# Altium schematic sheet K60P144.SchDoc
size A3
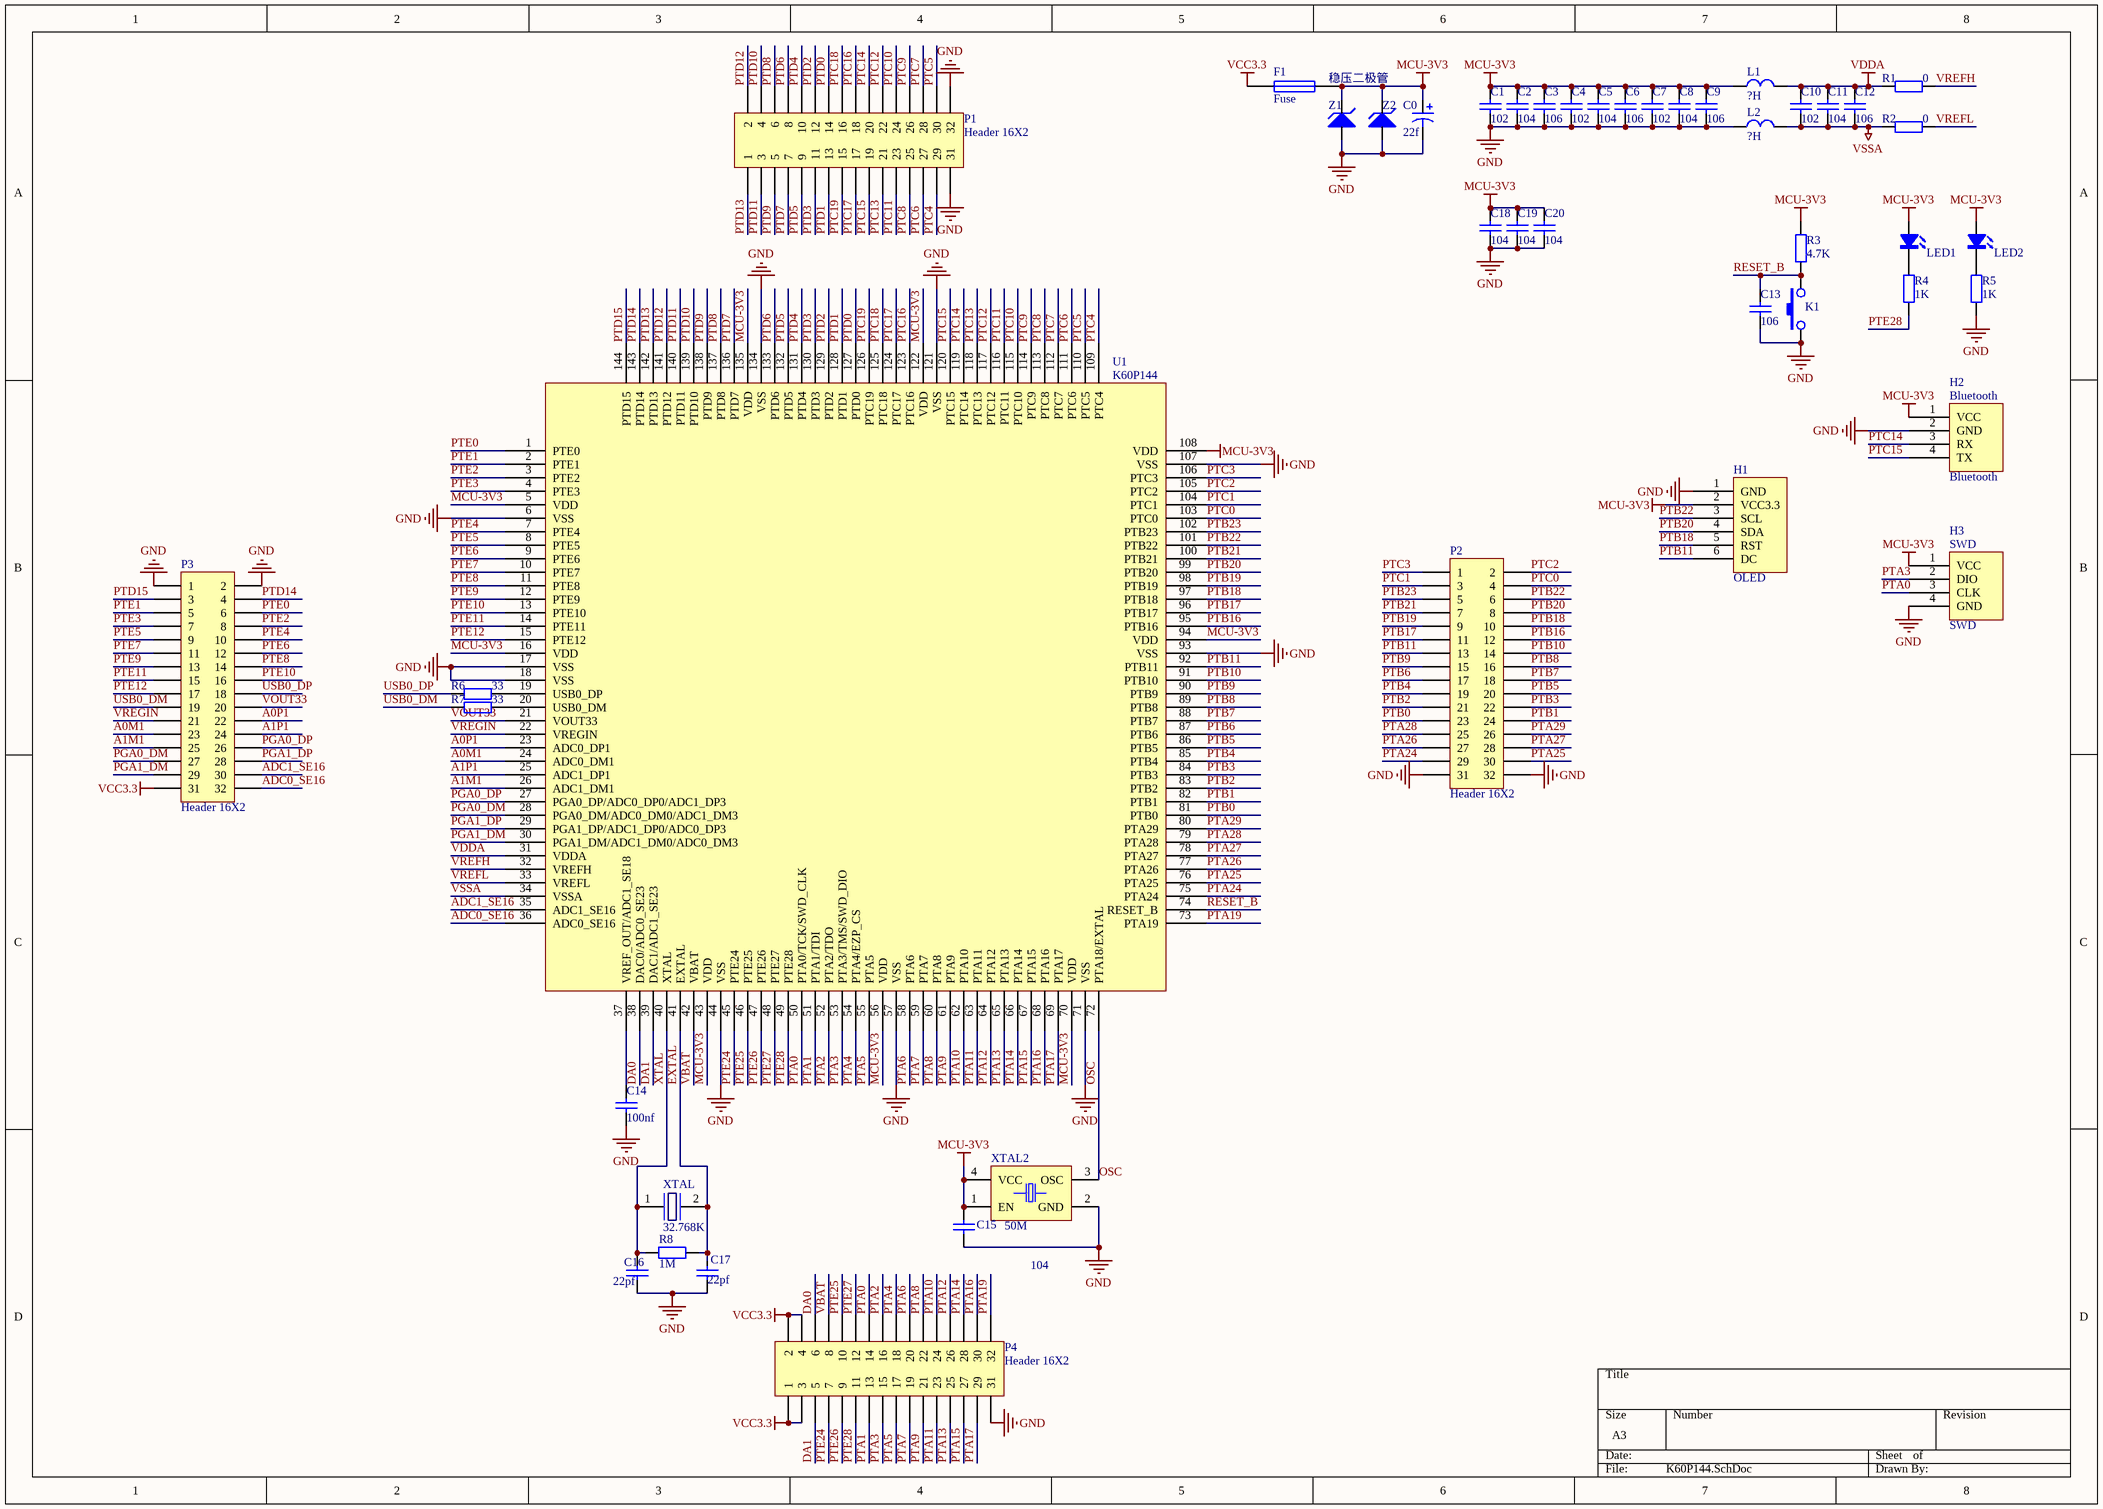
[diagram p0: K60P144.SchDoc]

## Parts
C0  22f  [3528-B-TA]
C1  102  [0805-0C]
C2  104  [0805-0C]
C3  106  [0805-0C]
C4  102  [0805-0C]
C5  104  [0805-0C]
C6  106  [0805-0C]
C7  102  [0805-0C]
C8  104  [0805-0C]
C9  106  [0805-0C]
C10  102  [0805-0C]
C11  104  [0805-0C]
C12  106  [0805-0C]
C13  106  [0805-0C]
C14  100nf  [0805-0C]
C15  104  [0805-0C]
C16  22pf  [0805-0C]
C17  22pf  [0805-0C]
C18  104  [0805-0C]
C19  104  [0805-0C]
C20  104  [0805-0C]
F1  Fuse  [1206R]
H1  OLED  [S0P6]
H2  Bluetooth  [S0P4]
H3  SWD  [S0P4]
K1  KEY  [SW_PB2_A1]  (value not drawn)
L1  ?H  [1206C]
L2  ?H  [1206C]
LED1  LED  [0805LED1]  (value not drawn)
LED2  LED  [0805LED1]  (value not drawn)
P1  Header 16X2  [201S2X16]
P2  Header 16X2  [201S2X16]
P3  Header 16X2  [201S2X16]
P4  Header 16X2  [201S2X16]
R1  0  [0603-r]
R2  0  [0603-r]
R3  4.7K  [0603-r]
R4  1K  [0603-r]
R5  1K  [0603-r]
R6  33  [0603-r]
R7  33  [0603-r]
R8  1M  [0603-r]
U1  K60P144  [LQFP144]
XTAL  32.768K  [XTAL1-KHz-直插3]
XTAL2  50M  [XTAL-3225]
Z1  Zener  [1206]  (value not drawn)
Z2  稳压二极管  [1206]

## Nets
GND: C0.2 C1.1 C2.1 C3.1 C4.1 C5.1 C6.1 C7.1 C8.1 C9.1 C13.1 C14.1 C15.1 C16.1 C17.1 C18.1 C19.1 C20.1 H1.1(GND) H2.2(GND) H3.4(GND) K1.1 L2.1 P1.31 P1.32 P2.31 P2.32 P3.1 P3.2 P4.31 R5.1 U1.6(VSS) U1.17(VSS) U1.18(VSS) U1.44(VSS) U1.57(VSS) U1.71(VSS) U1.93(VSS) U1.107(VSS) U1.121(VSS) U1.134(VSS) XTAL2.2(GND) Z1.1(A) Z2.1(A)
MCU-3V3: C0.1 C1.2 C2.2 C3.2 C4.2 C5.2 C6.2 C7.2 C8.2 C9.2 C15.2 C18.2 C19.2 C20.2 F1.1 H1.2(VCC3.3) H2.1(VCC) H3.1(VCC) L1.1 LED1.1(K) LED2.1(K) R3.2 U1.5(VDD) U1.16(VDD) U1.43(VDD) U1.56(VDD) U1.70(VDD) U1.94(VDD) U1.108(VDD) U1.122(VDD) U1.135(VDD) XTAL2.1(EN) XTAL2.4(VCC) Z1.2(K) Z2.2(K)
VCC3.3: F1.2 P3.31 P4.1 P4.2 P4.3 P4.4
VDDA: C10.2 C11.2 C12.2 L1.2 R1.1 U1.31(VDDA)
VSSA: C10.1 C11.1 C12.1 L2.2 R2.1 U1.34(VSSA)
A0M1: P3.23 U1.24(ADC0_DM1)
A0P1: P3.22 U1.23(ADC0_DP1)
A1M1: P3.25 U1.26(ADC1_DM1)
A1P1: P3.24 U1.25(ADC1_DP1)
ADC0_SE16: P3.32 U1.36(ADC0_SE16)
ADC1_SE16: P3.30 U1.35(ADC1_SE16)
DA0: P4.6 U1.38(DAC0/ADC0_SE23)
DA1: P4.5 U1.39(DAC1/ADC1_SE23)
EXTAL: C17.2 R8.2 U1.41(EXTAL) XTAL.2
OSC: U1.72(PTA18/EXTAL) XTAL2.3(OSC)
PGA0_DM: P3.27 U1.28(PGA0_DM/ADC0_DM0/ADC1_DM3)
PGA0_DP: P3.26 U1.27(PGA0_DP/ADC0_DP0/ADC1_DP3)
PGA1_DM: P3.29 U1.30(PGA1_DM/ADC1_DM0/ADC0_DM3)
PGA1_DP: P3.28 U1.29(PGA1_DP/ADC1_DP0/ADC0_DP3)
PTA0: H3.3(CLK) P4.14 U1.50(PTA0/TCK/SWD_CLK)
PTA1: P4.13 U1.51(PTA1/TDI)
PTA2: P4.16 U1.52(PTA2/TDO)
PTA3: H3.2(DIO) P4.15 U1.53(PTA3/TMS/SWD_DIO)
PTA4: P4.18 U1.54(PTA4/EZP_CS)
PTA5: P4.17 U1.55(PTA5)
PTA6: P4.20 U1.58(PTA6)
PTA7: P4.19 U1.59(PTA7)
PTA8: P4.22 U1.60(PTA8)
PTA9: P4.21 U1.61(PTA9)
PTA10: P4.24 U1.62(PTA10)
PTA11: P4.23 U1.63(PTA11)
PTA12: P4.26 U1.64(PTA12)
PTA13: P4.25 U1.65(PTA13)
PTA14: P4.28 U1.66(PTA14)
PTA15: P4.27 U1.67(PTA15)
PTA16: P4.30 U1.68(PTA16)
PTA17: P4.29 U1.69(PTA17)
PTA19: P4.32 U1.73(PTA19)
PTA24: P2.29 U1.75(PTA24)
PTA25: P2.30 U1.76(PTA25)
PTA26: P2.27 U1.77(PTA26)
PTA27: P2.28 U1.78(PTA27)
PTA28: P2.25 U1.79(PTA28)
PTA29: P2.26 U1.80(PTA29)
PTB0: P2.23 U1.81(PTB0)
PTB1: P2.24 U1.82(PTB1)
PTB2: P2.21 U1.83(PTB2)
PTB3: P2.22 U1.84(PTB3)
PTB4: P2.19 U1.85(PTB4)
PTB5: P2.20 U1.86(PTB5)
PTB6: P2.17 U1.87(PTB6)
PTB7: P2.18 U1.88(PTB7)
PTB8: P2.16 U1.89(PTB8)
PTB9: P2.15 U1.90(PTB9)
PTB10: P2.14 U1.91(PTB10)
PTB11: H1.6(DC) P2.13 U1.92(PTB11)
PTB16: P2.12 U1.95(PTB16)
PTB17: P2.11 U1.96(PTB17)
PTB18: H1.5(RST) P2.10 U1.97(PTB18)
PTB19: P2.9 U1.98(PTB19)
PTB20: H1.4(SDA) P2.8 U1.99(PTB20)
PTB21: P2.7 U1.100(PTB21)
PTB22: H1.3(SCL) P2.6 U1.101(PTB22)
PTB23: P2.5 U1.102(PTB23)
PTC0: P2.4 U1.103(PTC0)
PTC1: P2.3 U1.104(PTC1)
PTC2: P2.2 U1.105(PTC2)
PTC3: P2.1 U1.106(PTC3)
PTC4: P1.29 U1.109(PTC4)
PTC5: P1.30 U1.110(PTC5)
PTC6: P1.27 U1.111(PTC6)
PTC7: P1.28 U1.112(PTC7)
PTC8: P1.25 U1.113(PTC8)
PTC9: P1.26 U1.114(PTC9)
PTC10: P1.24 U1.115(PTC10)
PTC11: P1.23 U1.116(PTC11)
PTC12: P1.22 U1.117(PTC12)
PTC13: P1.21 U1.118(PTC13)
PTC14: H2.3(RX) P1.20 U1.119(PTC14)
PTC15: H2.4(TX) P1.19 U1.120(PTC15)
PTC16: P1.18 U1.123(PTC16)
PTC17: P1.17 U1.124(PTC17)
PTC18: P1.16 U1.125(PTC18)
PTC19: P1.15 U1.126(PTC19)
PTD0: P1.14 U1.127(PTD0)
PTD1: P1.13 U1.128(PTD1)
PTD2: P1.12 U1.129(PTD2)
PTD3: P1.11 U1.130(PTD3)
PTD4: P1.10 U1.131(PTD4)
PTD5: P1.9 U1.132(PTD5)
PTD6: P1.8 U1.133(PTD6)
PTD7: P1.7 U1.136(PTD7)
PTD8: P1.6 U1.137(PTD8)
PTD9: P1.5 U1.138(PTD9)
PTD10: P1.4 U1.139(PTD10)
PTD11: P1.3 U1.140(PTD11)
PTD12: P1.2 U1.141(PTD12)
PTD13: P1.1 U1.142(PTD13)
PTD14: P3.4 U1.143(PTD14)
PTD15: P3.3 U1.144(PTD15)
PTE0: P3.6 U1.1(PTE0)
PTE1: P3.5 U1.2(PTE1)
PTE2: P3.8 U1.3(PTE2)
PTE3: P3.7 U1.4(PTE3)
PTE4: P3.10 U1.7(PTE4)
PTE5: P3.9 U1.8(PTE5)
PTE6: P3.12 U1.9(PTE6)
PTE7: P3.11 U1.10(PTE7)
PTE8: P3.14 U1.11(PTE8)
PTE9: P3.13 U1.12(PTE9)
PTE10: P3.16 U1.13(PTE10)
PTE11: P3.15 U1.14(PTE11)
PTE12: P3.17 U1.15(PTE12)
PTE24: P4.7 U1.45(PTE24)
PTE25: P4.10 U1.46(PTE25)
PTE26: P4.9 U1.47(PTE26)
PTE27: P4.12 U1.48(PTE27)
PTE28: P4.11 R4.1 U1.49(PTE28)
RESET_B: C13.2 K1.2 R3.1 U1.74(RESET_B)
USB0_DM: P3.19 R7.1
USB0_DP: P3.18 R6.1
VBAT: P4.8 U1.42(VBAT)
VOUT33: P3.20 U1.21(VOUT33)
VREFH: R1.2 U1.32(VREFH)
VREFL: R2.2 U1.33(VREFL)
VREGIN: P3.21 U1.22(VREGIN)
XTAL: C16.2 R8.1 U1.40(XTAL) XTAL.1
NetC14_2: C14.2 U1.37(VREF_OUT/ADC1_SE18)
NetLED1_2: LED1.2(A) R4.2
NetLED2_2: LED2.2(A) R5.2
NetR6_2: R6.2 U1.19(USB0_DP)
NetR7_2: R7.2 U1.20(USB0_DM)

## Library data of the parts
C0 = CAP-TAN
C1-C20 = CAP
K1 = KEY: 按键
L1 L2 = Inductor
R1-R8 = RES
XTAL = XTAL-RTC
XTAL2 = XTAL
Z2 = Zener